# EAGLE design SmartCar ESP V2 (EAGLE 9.6.2)
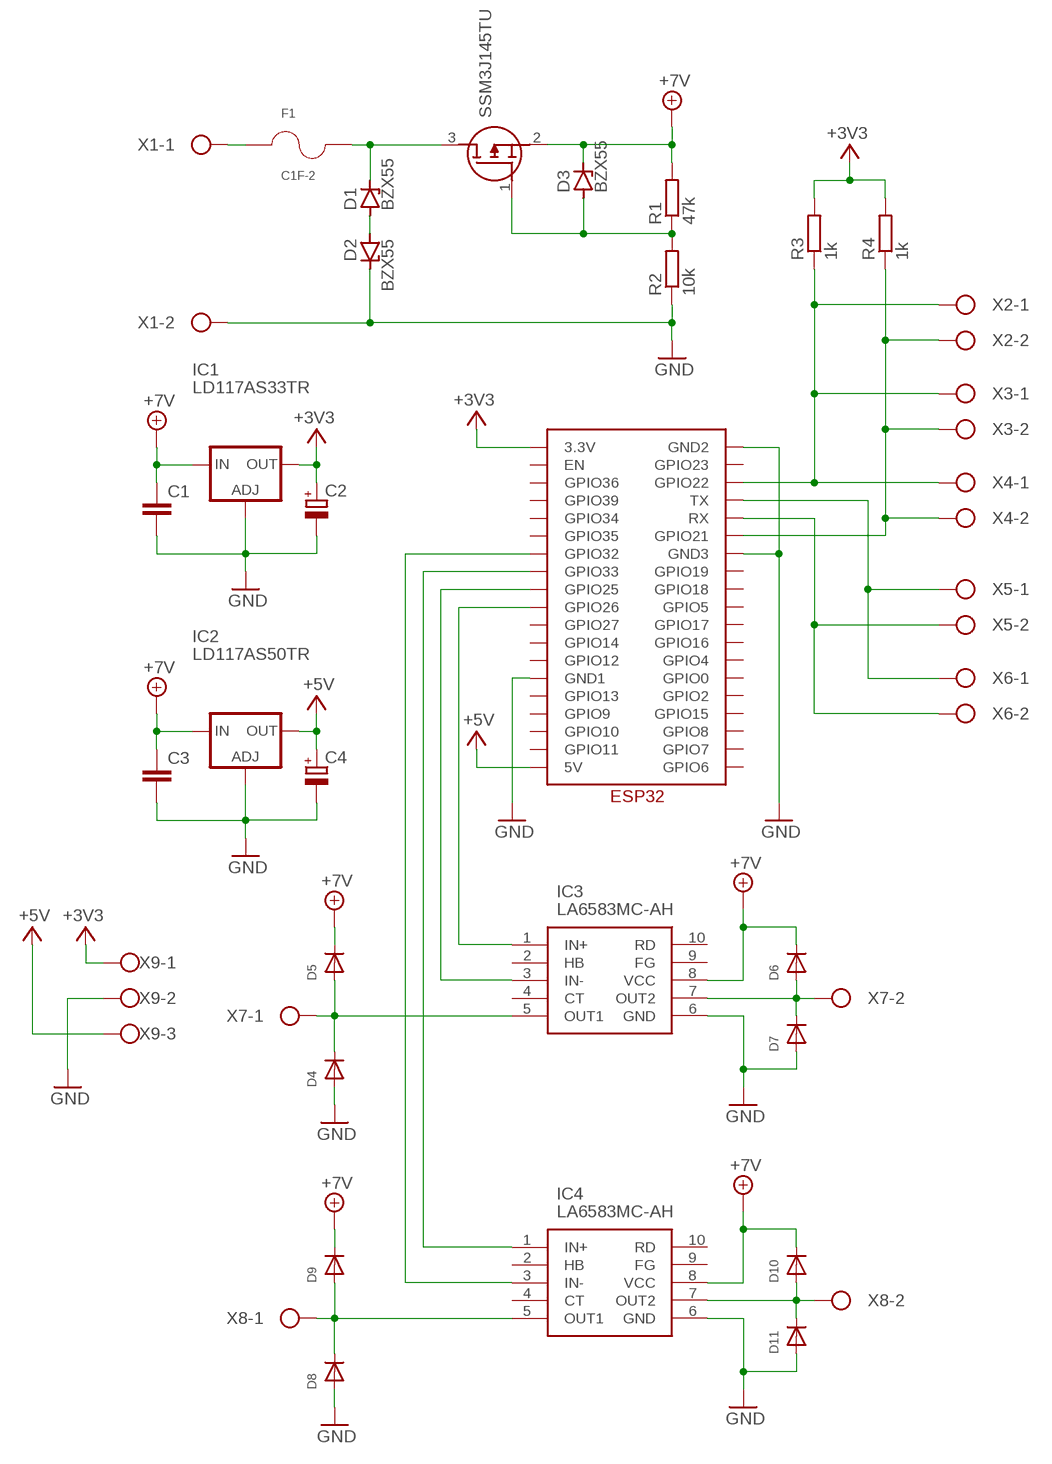
[diagram p0: schematic, sheet 1]

## Parts
C1  C-EUC0805  [C0805]
C2  CPOL-EUE2,5-6E  [E2,5-6E]
C3  C-EUC0805  [C0805]
C4  CPOL-EUE2,5-6E  [E2,5-6E]
D1  BZX55  [DO35Z10]
D2  BZX55  [DO35Z10]
D3  BZX55  [DO35Z10]
D4  DIODESMA  [SMADIODE]
D5  DIODESMA  [SMADIODE]
D6  DIODESMA  [SMADIODE]
D7  DIODESMA  [SMADIODE]
D8  DIODESMA  [SMADIODE]
D9  DIODESMA  [SMADIODE]
D10  DIODESMA  [SMADIODE]
D11  DIODESMA  [SMADIODE]
F1  C1F-2  [FUSC3215X83N]
IC1  LD117AS33TR  [SOT223]
IC2  LD117AS50TR  [SOT223]
IC3  LA6583MC-AH  [SOP100P620X155-10N]
IC4  LA6583MC-AH  [SOP100P620X155-10N]
R1  47k  R-EU_R0805  [R0805]
R2  10k  R-EU_R0805  [R0805]
R3  1k  R-EU_R0805  [R0805]
R4  1k  R-EU_R0805  [R0805]
U$1  ESP32  [ESP32]
U$2  SSM3J145TU  [SOTFL65P210X75-3N]
X1  W237-102  [W237-102]
X2  W237-102  [W237-102]
X3  W237-102  [W237-102]
X4  W237-102  [W237-102]
X5  W237-102  [W237-102]
X6  W237-102  [W237-102]
X7  W237-102  [W237-102]
X8  W237-102  [W237-102]
X9  W237-103  [W237-103]

## Nets
+3V3: C2.+ IC1.4(OUT) R3.2 R4.2 U$1.3.3V X9.1
+5V: C4.+ IC2.4(OUT) U$1.5V X9.3
+7V: C1.1 C3.1 D3.C D5.C D6.C D9.C D10.C IC1.3(IN) IC2.3(IN) IC3.8(VCC) IC4.8(VCC) R1.2 U$2.2(S)
GND: C1.2 C2.- C3.2 C4.- D2.C D4.A D7.A D8.A D11.A IC1.1(ADJ) IC2.1(ADJ) IC3.6(GND) IC4.6(GND) R2.1 U$1.GND1 U$1.GND2 U$1.GND3 X1.2 X9.2
N$1: F1.1 X1.1
N$2: D1.A D2.A
N$3: D1.C F1.2 U$2.3(D)
N$4: R4.1 U$1.GPIO21 X2.2 X3.2 X4.2
N$5: U$1.TX X5.1 X6.1
N$7: D3.A R1.1 R2.2 U$2.1(G)
N$8: R3.1 U$1.GPIO22 X2.1 X3.1 X4.1
N$9: D4.C D5.A IC3.5(OUT1) X7.1
N$10: D6.A D7.C IC3.7(OUT2) X7.2
N$11: D10.A D11.C IC4.7(OUT2) X8.2
N$12: D8.C D9.A IC4.5(OUT1) X8.1
N$13: IC3.1(IN+) U$1.GPIO26
N$14: IC3.3(IN-) U$1.GPIO25
N$15: IC4.1(IN+) U$1.GPIO33
N$16: IC4.3(IN-) U$1.GPIO32
N$17: U$1.RX X5.2 X6.2
Unconnected: IC3.2(HB) IC3.4(CT) IC3.9(FG) IC3.10(RD) IC4.2(HB) IC4.4(CT) IC4.9(FG) IC4.10(RD) U$1.EN U$1.GPIO0 U$1.GPIO2 U$1.GPIO4 U$1.GPIO5 U$1.GPIO6 U$1.GPIO7 U$1.GPIO8 U$1.GPIO9 U$1.GPIO10 U$1.GPIO11 U$1.GPIO12 U$1.GPIO13 U$1.GPIO14 U$1.GPIO15 U$1.GPIO16 U$1.GPIO17 U$1.GPIO18 U$1.GPIO19 U$1.GPIO23 U$1.GPIO27 U$1.GPIO34 U$1.GPIO35 U$1.GPIO36 U$1.GPIO39

## Library data of the parts
C1 C3 = rcl:C-EU: CAPACITOR, European symbol; SPICEPREFIX: C
C2 C4 = rcl:CPOL-EU: POLARIZED CAPACITOR, European symbol; SPICEPREFIX: C
D1-D3 = diode:BZX55: Z DIODE
D4-D11 = adafruit:DIODE: Diode SMADIODE - SMA Surface Mount Package 20V 1A Schottky Diode Digikey: 641-1014-6-ND DO-1N4148 - Through Hole Small Current Diode SOD-123 20V 1 A (.5mV Vf) Schottky Diode - Digikey: MBRX120TPMSCT-ND SOD-323 10V 570mA (.38mV Vf, 3ns) Schottky Diode - Digikey: ZLLS410CT-ND SOD-523 30V 30mA Schottky Diode (RB751S-40TE61) - Digikey: RB751S-40TE61CT-ND SOT23-R/W - SOT23 Package (R = Solder Paste/Reflow Ovens, W = Hand-Soldering) BAT54Film 40V 300mA - Digikey: 497-7162-1-ND
F1 = C1F-2:C1F-2: C1F 1 (0685F1000-01) | 1206 SMT Fuse | Fast Acting | 1A; A_MAX: 0.83; A_MIN: 0.83; A_NOM: 0.83; D_MAX: 3.4; D_MIN: 3.0; D_NOM: 3.2; E_MAX: 1.78; E_MIN: 1.38; E_NOM: 1.58; L1_MAX: 0.76; L1_MIN: 0.26; L1_NOM: 0.51; L_MAX: 0.76; L_MIN: 0.26; L_NOM: 0.51; MANUFACTURER: Bel Fuse Inc.; PARTREV: Jan2019; STANDARD: IPC 7351B
IC1 IC2 = v-reg:LD117A?*: Low drop fixed and adjustable positive voltage regulators 1 A Source: http://www.st.com/stonline/products/literature/ds/7194/ld1117axx.pdf
IC3 IC4 = LA6583MC-AH:LA6583MC-AH: Source: Datasheet <https://datasheet.datasheetarchive.com/originals/distributors/Datasheets-SFU1/DSASFU100015254.pdf>; HEIGHT: 1.55mm; MANUFACTURER_NAME: ON Semiconductor; MANUFACTURER_PART_NUMBER: LA6583MC-AH; MOUSER_PART_NUMBER: 863-LA6583MC-AH; MOUSER_PRICE-STOCK: https://www.mouser.com/Search/Refine.aspx?Keyword=863-LA6583MC-AH
R1-R4 = rcl:R-EU_: RESISTOR, European symbol; SPICEPREFIX: R
U$1 = ESP32:ESP32
U$2 = SSM3J145TU:SSM3J145TU
X1-X8 = con-wago-500:W237-102: WAGO SCREW CLAMP; MPN: 237-102; OC_FARNELL: unknown; OC_NEWARK: 70K9898
X9 = con-wago-500:W237-103: WAGO SCREW CLAMP; MPN: 237-103; OC_FARNELL: unknown; OC_NEWARK: 18M7116

## Board
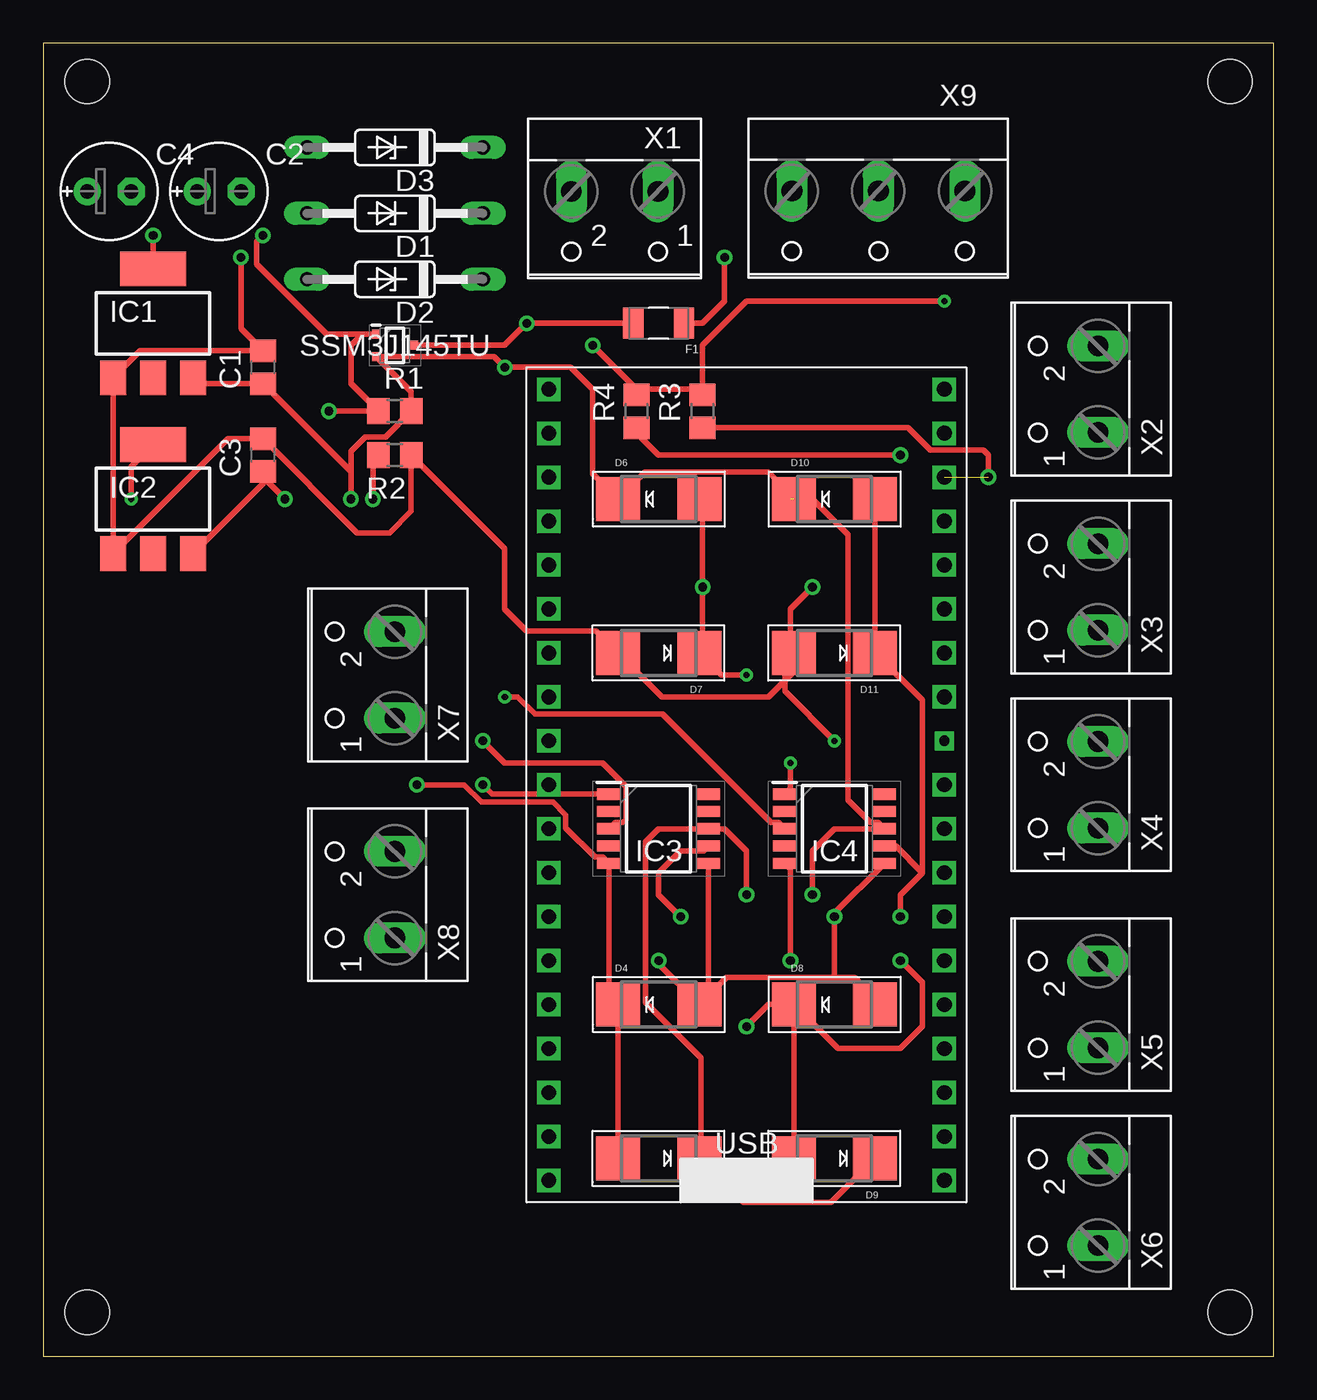
[diagram p1: board, top side]
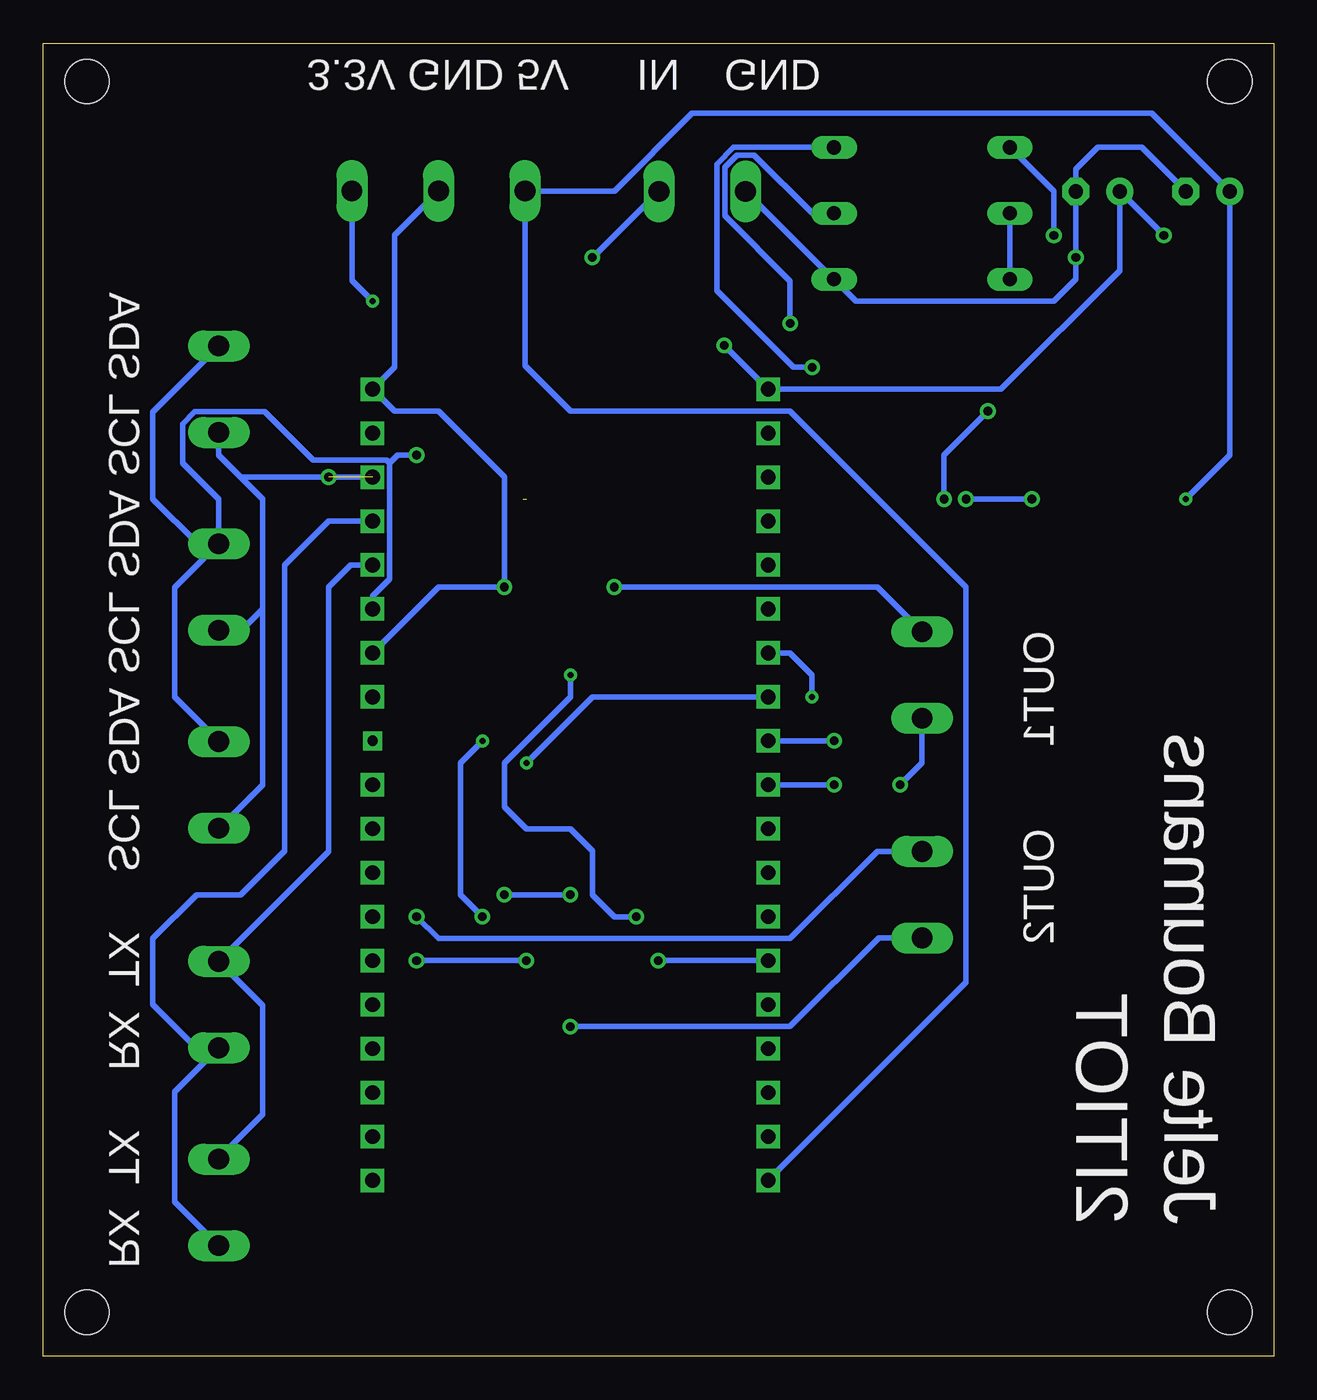
[diagram p2: board, bottom side, seen from below]

Size 71.1 x 75.87 mm. Coordinates in mm from the lower left corner, seen from the top.
Outline: 0,0 71.1,0 71.1,75.87 0,75.87 0,0
Copper layers (1*16): Top 0.035mm / dielectric 0.15mm / Bottom 0.035mm
Design rules "default": minimum track width 6mil, minimum drill 0.35mm, track to track 6mil, track to pad 6mil, pad to pad 6mil, via to via 6mil, smd to smd 6mil, copper to edge 40mil, drill to drill 6mil, minimum pad ring 10mil, minimum via ring 8mil, stop-mask expansion 4mil, vias tented up to drill 0mil, thermal gap 10mil
Holes 2.54 mm at 2.54,73.66 2.54,2.54 68.58,73.66 68.58,2.54

### Footprints (pad centres in the part's own frame; a part is rotated, then mirrored left to right if it is on the bottom)
C0805 = smd 1.3 x 1.5: 1 -0.95,0; 2 0.95,0
E2,5-6E = drill 0.813 pad 1.575: + -1.27,0 | drill 0.813 pad 1.575 octagon: - 1.27,0
DO35Z10 = drill 0.813 long: A 5.08,0; C -5.08,0
SMADIODE = smd 2.54 x 2.54: A 2.349,0; C -2.349,0
FUSC3215X83N = smd 1.17 x 1.8: 1 -1.47,0; 2 1.47,0
SOT223 = smd 1.5 x 2: 1 -2.3,-3.15; 2 0,-3.15; 3 2.3,-3.15 | smd 3.8 x 2: 4 0,3.15
SOP100P620X155-10N = smd 1.35 x 0.65: 1 -2.875,2; 2 -2.875,1; 3 -2.875,0; 4 -2.875,-1; 5 -2.875,-2; 6 2.875,-2; 7 2.875,-1; 8 2.875,0; 9 2.875,1; 10 2.875,2
R0805 = smd 1.3 x 1.5: 1 -0.95,0; 2 0.95,0
ESP32 = drill 0.85 square: 3.3V 1.27,46.99; 5V 1.27,1.27; EN 1.27,44.45; GND1 1.27,13.97; GND2 24.13,46.99; GND3 24.13,31.75; GPIO0 24.13,13.97; GPIO2 24.13,11.43; GPIO4 24.13,16.51; GPIO5 24.13,24.13; GPIO6 24.13,1.27; GPIO7 24.13,3.81; GPIO8 24.13,6.35; GPIO9 1.27,8.89; GPIO10 1.27,6.35; GPIO11 1.27,3.81; GPIO12 1.27,16.51; GPIO13 1.27,11.43; GPIO14 1.27,19.05; GPIO15 24.13,8.89; GPIO16 24.13,19.05; GPIO17 24.13,21.59; GPIO19 24.13,29.21; GPIO21 24.13,34.29; GPIO22 24.13,41.91; GPIO23 24.13,44.45; GPIO25 1.27,26.67; GPIO26 1.27,24.13; GPIO27 1.27,21.59; GPIO32 1.27,31.75; GPIO33 1.27,29.21; GPIO34 1.27,36.83; GPIO35 1.27,34.29; GPIO36 1.27,41.91; GPIO39 1.27,39.37; RX 24.13,36.83; TX 24.13,39.37 | drill 0.6 square: GPIO18 24.13,26.67
SOTFL65P210X75-3N = smd 0.475 x 0.52: 1 -1.088,0.65; 2 -1.088,-0.65; 3 1.088,0
W237-102 = drill 1.194 long: 1 -2.5,-1.27; 2 2.5,-1.27
W237-103 = drill 1.194 long: 1 -5,-1.29; 2 0,-1.29; 3 5,-1.29

### Placement (x,y rotation side)
C1  12.7,57.15 90 top
C2  10.16,67.31 0 top
C3  12.7,52.07 90 top
C4  3.81,67.31 0 top
D1  20.32,66.04 180 top
D2  20.32,62.23 180 top
D3  20.32,69.85 180 top
D4  35.56,20.32 0 top
D5  35.56,11.43 180 top
D6  35.56,49.53 0 top
D7  35.56,40.64 180 top
D8  45.72,20.32 0 top
D9  45.72,11.43 180 top
D10  45.72,49.53 0 top
D11  45.72,40.64 180 top
F1  35.56,59.69 180 top
IC1  6.35,59.69 0 top
IC2  6.35,49.53 0 top
IC3  35.56,30.48 0 top
IC4  45.72,30.48 0 top
R1  20.32,54.61 0 top
R2  20.32,52.07 180 top
R3  38.1,54.61 90 top
R4  34.29,54.61 90 top
U$1  27.94,8.89 0 top
U$2  20.32,58.42 0 top
X1  33.02,66.04 180 top
X2  59.69,55.88 90 top
X3  59.69,44.45 90 top
X4  59.69,33.02 90 top
X5  59.69,20.32 90 top
X6  59.69,8.89 90 top
X7  19.05,39.37 90 top
X8  19.05,26.67 90 top
X9  48.26,66.04 180 top

### Tracks (layer width: path | path; a pad name or v marks a point on that pad's centre or on a via)
+3V3  (via drill 0.35, 0.5)
  Top 0.152: R3.2 37.78,55.88
  Top 0.305: 37.78,55.88 34.61,55.88 34.45,55.72 | 34.45,55.72 R4.2 | v6.35,64.77 IC1.4 | R3.2 38.1,58.42 40.64,60.96 v52.07,60.96 | v31.75,58.42 34.45,55.72
  Bottom 0.305: v6.35,64.77 C2.+ 8.89,62.74 15.76,55.88 U$1.3.3V v31.75,58.42 | X9.1 53.26,62.15 v52.07,60.96
+5V  (via drill 0.35)
  Top 0.305: v5.08,49.53 5.08,51.41 IC2.4
  Bottom 0.305: U$1.5V 17.78,21.59 17.78,44.45 27.94,54.61 40.64,54.61 43.26,57.23 X9.3 38.09,67.33 33.6,71.82 7.05,71.82 C4.+ 2.54,52.07 v5.08,49.53
+7V  (via drill 0.5)  (1 unrouted)
  Top 0.305: 17.78,51.12 17.78,52.31 18.59,53.12 19.79,53.12 R1.2 21.27,55.73 U$2.2 26.05,57.77 v26.67,57.15 30.48,57.15 31.75,55.88 31.75,50.99 D6.C 34.78,51.1 41.91,51.1 43.18,49.84 43.18,49.53 | 17.78,51.12 v17.78,49.53 | IC1.3 8.99,56.2 C1.1 17.78,51.12 | C3.1 12.7,50.8 | 12.7,50.8 12.7,50.43 IC2.3 | v13.97,49.53 12.7,50.8 | D5.C 38.01,11.34 | 38.01,11.34 40.45,8.89 45.53,8.89 D9.C | 38.01,11.34 38.01,17.25 34.8,20.46 34.8,29.72 35.56,30.48 38.1,30.48 38.27,30.31 IC3.8 39.37,30.48 40.64,29.21 v40.64,26.67 | D10.C 44.45,49.53 46.49,47.48 46.49,32.15 47.79,30.85 48.23,30.85 IC4.8 45.72,30.48 44.45,29.21 v44.45,26.67
  Bottom 0.305: v17.78,49.53 v13.97,49.53 | D3.C 29.82,69.85 29.83,69.86 31.21,69.86 32.18,68.89 32.18,61.59 27.74,57.15 v26.67,57.15 | v40.64,26.67 v44.45,26.67
GND  (via drill 0.35, 0.5)
  Top 0.152: 38.83,28.48 IC3.6
  Top 0.305: D11.A 43.27,40.55 | 43.27,40.55 42.84,40.11 42.84,38.44 v45.72,35.56 | C1.2 5.61,58.1 IC1.1 IC2.1 10.69,53.02 C3.2 18.14,47.58 20,47.58 21.27,48.85 R2.1 26.67,46.67 26.67,43.18 27.94,41.91 31.94,41.91 D7.A 35.75,38.1 41.91,38.1 43.27,39.47 43.27,40.55 | 12.7,58.42 C1.2 | C1.2 11.43,59.37 v11.43,63.5 | D4.A 38.64,21.05 38.44,21.25 IC3.6 | D8.A 48.26,20.51 46.88,21.89 45.72,21.89 | v44.45,44.45 43.18,43.18 43.18,40.64 43.27,40.55 | D4.A 35.56,22.67 v35.56,22.86 | IC4.6 45.72,25.61 v45.72,25.4 45.72,21.89 | D4.A 39.48,21.89 45.72,21.89
  Bottom 0.305: C4.- 7.62,69.85 10.16,69.85 11.43,68.58 C2.- v11.43,63.5 11.43,62.23 12.7,60.96 24.13,60.96 D2.C 25.44,62.23 X1.2 | X9.2 50.8,64.79 50.8,57.15 U$1.GND2 50.8,54.61 48.26,54.61 44.45,50.8 v44.45,44.45 48.26,44.45 U$1.GND3 | v35.56,22.86 U$1.GND1 | v45.72,35.56 46.99,34.29 46.99,26.67 v45.72,25.4
N$1  (via drill 0.5)
  Top 0.305: v39.37,63.5 39.37,60.96 38.1,59.69 F1.1
  Bottom 0.305: X1.1 39.33,63.5 v39.37,63.5
N$2
  Bottom 0.305: D1.A D2.A
N$3  (via drill 0.5)
  Top 0.305: 34.29,59.69 F1.2 v27.94,59.69 26.67,58.42 U$2.3
  Bottom 0.305: D1.C 26.66,66.04 30.02,69.41 31.02,69.41 31.72,68.7 31.72,65.92 27.94,62.14 v27.94,59.69
N$4  (via drill 0.5)
  Top 0.152: R4.1 34.29,53.34
  Top 0.305: 34.29,53.34 35.56,52.07 v49.53,52.07
  Bottom 0.305: X2.2 64.77,54.57 64.77,49.53 62.19,46.95 X3.2 | X3.2 63.5,44.41 63.5,38.1 60.96,35.56 X4.2 | 51.09,51.6 51.27,51.78 55.5,51.78 58.3,54.58 62.35,54.58 63.06,53.88 63.06,51.61 60.96,49.52 X3.2 | U$1.GPIO21 52.07,43.93 51.09,44.91 51.09,51.6 | v49.53,52.07 50.62,52.07 51.09,51.6
N$5
  Bottom 0.152: 61,17.78 X5.1
  Bottom 0.305: U$1.TX 54.61,48.26 57.15,45.72 57.15,29.21 59.69,26.67 62.23,26.67 64.77,24.13 64.77,20.32 62.23,17.78 61,17.78 | X5.1 63.5,15.28 63.5,8.93 X6.1
N$7  (via drill 0.5)
  Top 0.305: 18.43,59.07 17.78,58.42 17.78,56.2 R1.1 v16.51,54.61 | 18.43,59.07 U$2.1 | v12.7,64.77 12.34,64.41 12.34,63.1 16.38,59.07 18.43,59.07 | v19.05,49.53 19.05,51.75 R2.2
  Bottom 0.305: D3.A 12.7,67.31 v12.7,64.77 | v16.51,54.61 19.05,52.07 v19.05,49.53
N$8  (via drill 0.5)  (1 unrouted)
  Top 0.152: R3.1 38.38,53.38
  Top 0.305: R3.1 49.96,53.66 51.27,52.36 54.32,52.36 54.61,52.07 v54.61,50.8
  Bottom 0.152: X2.1 60.96,53.34 | 60.92,41.91 X3.1 | X4.1 60.92,30.52
  Bottom 0.305: 60.96,53.34 60.96,52.07 59.69,50.8 | 59.69,50.8 58.42,49.53 58.42,43.18 | 58.42,43.18 59.69,41.91 60.92,41.91 | 60.92,30.52 58.42,33.02 58.42,43.18 | U$1.GPIO22 59.69,50.8
N$9  (via drill 0.5)
  Top 0.152: D4.C 33.12,20.41 | D5.A 33.12,11.53
  Top 0.305: D5.A D4.C 32.69,20.85 IC3.5 32.31,28.85 31.88,28.85 30.19,30.54 30.19,31.29 29.46,32.02 25.32,32.02 24.33,33.02 v21.59,33.02
  Bottom 0.305: v21.59,33.02 20.32,34.29 X7.1
N$10  (via drill 0.35, 0.5)
  Top 0.305: D6.A 38.1,49.53 v38.1,44.45 38.1,40.83 D7.C 39.18,39.37 v40.64,39.37 | IC3.7 38.16,29.21 36.83,29.21 35.56,27.94 35.56,26.67 v36.83,25.4
  Bottom 0.305: X7.2 22.9,44.45 v38.1,44.45 | v40.64,39.37 40.64,38.1 44.45,34.29 44.45,31.75 43.18,30.48 40.64,30.48 39.37,29.21 39.37,26.67 38.1,25.4 v36.83,25.4
N$11  (via drill 0.5)
  Top 0.305: D10.A D11.C 50.8,37.91 50.8,27.94 | IC4.7 49.26,29.48 50.8,27.94 | v49.53,25.4 49.53,26.67 50.8,27.94
  Bottom 0.305: X8.2 22.9,29.17 27.94,24.13 48.26,24.13 v49.53,25.4
N$12  (via drill 0.5)
  Top 0.305: D8.C 42.84,20.85 | D9.A D8.C | v40.64,19.05 41.91,20.32 D8.C | D8.C 45.91,17.78 49.53,17.78 50.8,19.05 50.8,21.59 v49.53,22.86 | IC4.5 43.18,28.14 v43.18,22.86
  Bottom 0.305: X8.1 22.82,24.17 27.94,19.05 v40.64,19.05 | v49.53,22.86 v43.18,22.86
N$13  (via drill 0.5)
  Top 0.305: IC3.1 25.94,32.48 v25.4,33.02
  Bottom 0.305: v25.4,33.02 U$1.GPIO26
N$14  (via drill 0.5)
  Top 0.305: IC3.3 33.05,30.85 33.49,30.85 33.66,31.03 33.66,32.93 32.31,34.29 26.67,34.29 v25.4,35.56
  Bottom 0.305: U$1.GPIO25 v25.4,35.56
N$15  (via drill 0.35)
  Top 0.305: v43.18,34.29 43.18,32.81 IC4.1
  Bottom 0.305: U$1.GPIO33 39.37,38.1 v43.18,34.29
N$16  (via drill 0.35)
  Top 0.305: IC4.3 42.48,30.85 42.04,30.85 35.78,37.12 28.41,37.12 27.42,38.1 v26.67,38.1
  Bottom 0.305: v26.67,38.1 26.67,39.37 27.94,40.64 U$1.GPIO32
N$17
  Bottom 0.152: 60.96,11.43 X6.2
  Bottom 0.305: U$1.RX 53.34,45.72 54.61,44.45 54.61,29.17 X5.2 58.42,20.28 58.42,13.97 60.96,11.43

### Text on the board
bNames: GND | IN | 3.3V GND 5V | SCL SDA | OUT1 | SCL SDA | OUT2 | SCL SDA | RX TX | Jelte Boumans | 2ITIOT | RX TX